# Altium schematic sheet Morpheus_LDO.SchDoc: LDO with Boost Converter
size Letter; CompanyName: Hello Inc.; DrawnBy: Dyke Shaffer; Organization: Hello Inc.; Revision: DVT; SheetNumber: 2; SheetTotal: 4
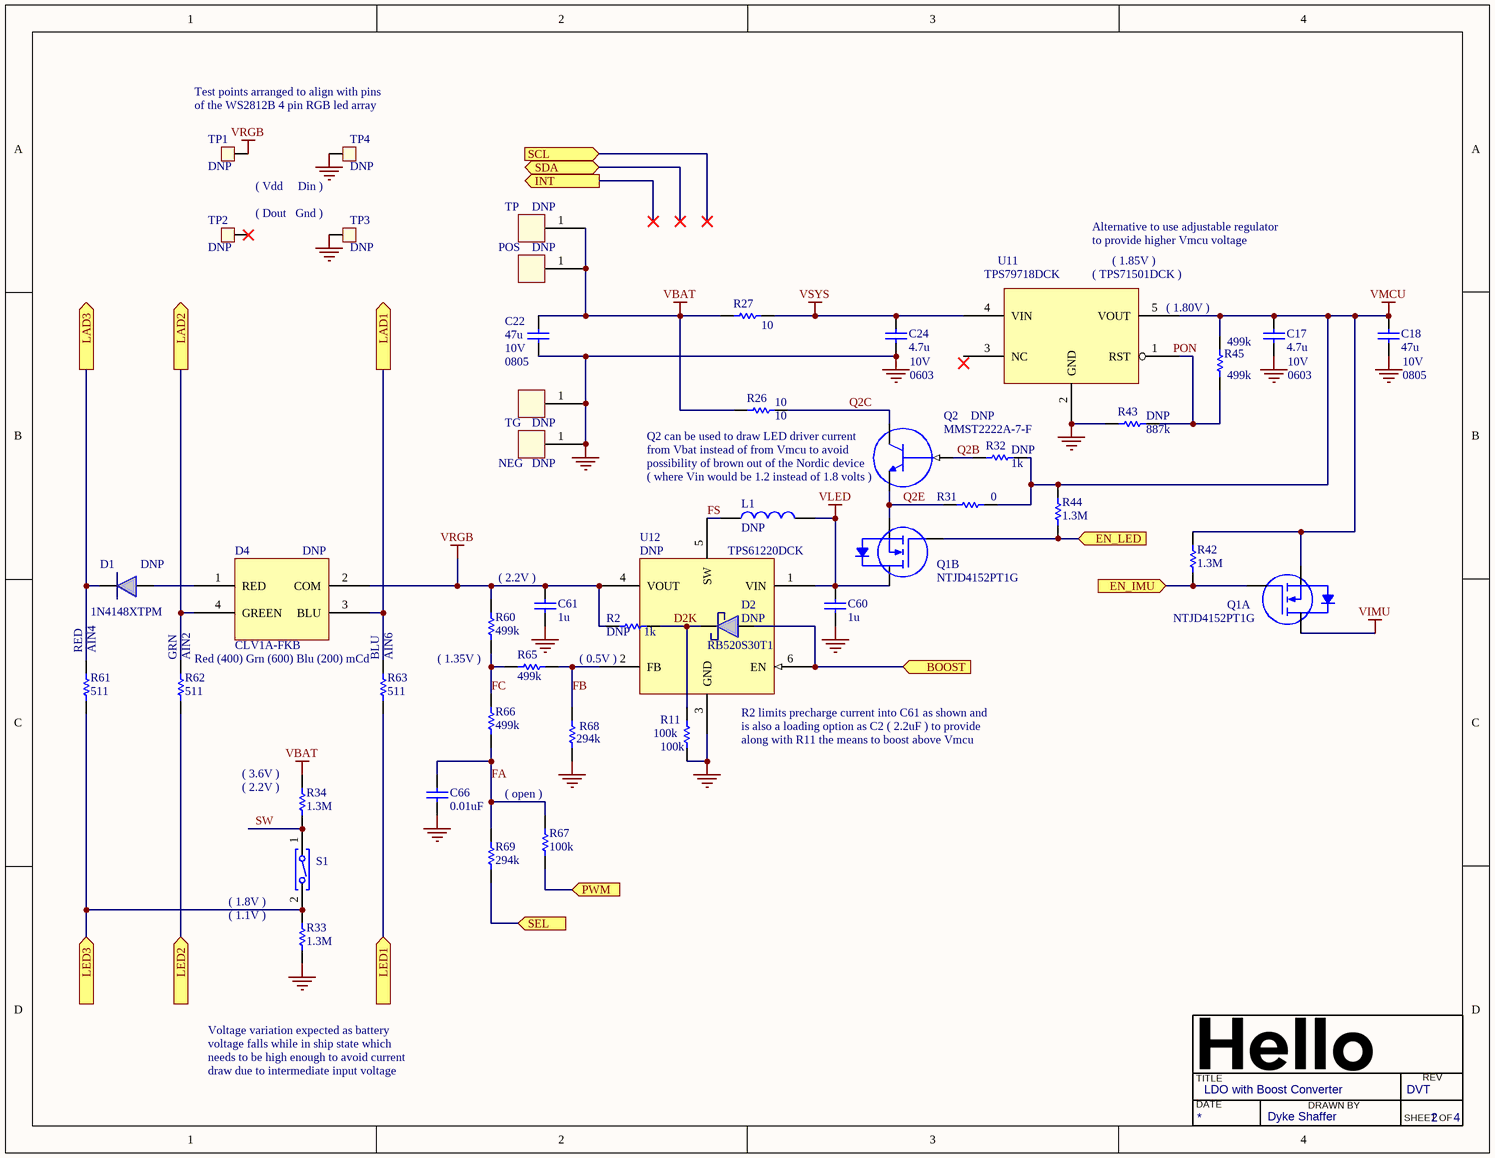
[diagram p0: Morpheus_LDO.SchDoc]

## Parts
C17  4.7u  Size: 0603  Voltage: 10V  [CAP0603_SENSE_DVT]
C18  47u  Size: 0805  Voltage: 10V  [CAP0805_SENSE_DVT]
C22  47u  Size: 0805  Voltage: 10V  [CAP0805_SENSE_DVT]
C24  4.7u  Size: 0603  Voltage: 10V  [CAP0603_SENSE_DVT]
C60  1u  [CAP0402_SENSE_DVT]
C61  1u  [CAP0402_SENSE_DVT]
C66  0.01uF  [CAP0402_SENSE_DVT]
D1  DNP  [SOD523]
D2  DNP  [SOD523]
D4  DNP  value Red (400) Grn (600) Blu (200) mCd  [PLCC150X290P280X320X190-4]
L1  DNP  [IND_1206]
NEG  DNP  [TP0875x050]
POS  DNP  [TP0875x050]
Q1  NTJD4152PT1G  [SOT65P212X110-6N]  (parts A,B of 2)
Q2  DNP  PN: MMST2222A-7-F  [SOT-323]
R2  DNP  value 1k  [RES0402_SENSE_DVT]
R11  100k  [RES0402_SENSE_DVT]
R26  10  [RES0402_SENSE_DVT]
R27  10  [RES0402_SENSE_DVT]
R31  value 0  [RES0402-SENSE-DVT]  (hidden comment: R_0_jumper_0.1_0402)
R32  DNP  value 1k  [RES0402_SENSE_DVT]
R33  1.3M  [RES0402_SENSE_DVT]
R34  1.3M  [RES0402_SENSE_DVT]
R42  1.3M  [RES0402_SENSE_DVT]
R43  DNP  value 887k  [RES0402_SENSE_DVT]
R44  1.3M  [RES0402_SENSE_DVT]
R45  499k  [RES0402_SENSE_DVT]
R60  499k  [RES0402_SENSE_DVT]
R61  511  [RES0402_SENSE_DVT]
R62  511  [RES0402_SENSE_DVT]
R63  511  [RES0402_SENSE_DVT]
R65  499k  [RES0402_SENSE_DVT]
R66  499k  [RES0402_SENSE_DVT]
R67  100k  [RES0402_SENSE_DVT]
R68  294k  [RES0402_SENSE_DVT]
R69  294k  [RES0402_SENSE_DVT]
S1  REED_SPST_NO  [REED-10x1.8]  (value not drawn)
TG  DNP  [TP0875x050]
TP  DNP  [TP0875x050]
TP1  DNP  [TP-0.8]
TP2  DNP  [TP-0.8]
TP3  DNP  [TP-0.8]
TP4  DNP  [TP-0.8]
U11  TPS79718DCK  [SOT65P212X110-5N]
U12  DNP  PN: TPS61220DCK  [SOT65P212X110-6N]

## Ports
BOOST (in), EN_IMU (in), EN_LED (in), INT (out), LAD1 (out), LAD2 (out), LAD3 (out), LED1 (in), LED2 (in), LED3 (in), PWM (in), SCL (in), SDA, SEL (in)

## Nets
GND: C17.1 C18.1 C22.1 C24.1 C60.1 C61.1 C66.1 NEG.1 R11.1 R33.1 R43.1 R68.1 TG.1 TP3.1 TP4.1 U11.2(GND) U12.3(GND)
VBAT: C22.2 POS.1 R26.1 R27.1 R34.2 TP.1
VIMU: Q1.6(D1)
VLED: C60.2 L1.1 Q1.3(D2) U12.1(VIN)
VMCU: C17.2 C18.2 Q1.1(S1) R31.2 R32.2 R42.2 R44.2 R45.2 U11.5(VOUT)
VRGB: C61.2 D4.2(COM) R2.1 R60.2 TP1.1 U12.4(VOUT)
VSYS: C24.2 R27.2 U11.4(VIN)
BOOST: D2.2(Anode) U12.6(EN) ; port BOOST
D2K: D2.1(Cathode) R2.2 R11.2
EN_IMU: Q1.2(G1) R42.1 ; port EN_IMU
EN_LED: Q1.5(G2) R44.1 ; port EN_LED
FA: C66.2 R66.1 R67.2 R69.2
FB: R65.1 R68.2 U12.2(FB)
FC: R60.1 R65.2 R66.2
FS: L1.2 U12.5(SW)
LAD1: D4.3(BLU) R63.2 ; port LAD1
LAD2: D4.4(GREEN) R62.2 ; port LAD2
LAD3: D1.1(Cathode) R61.2 ; port LAD3
LED1: R63.1 ; port LED1
LED2: R62.1 ; port LED2
LED3: R33.2 R61.1 S1.2 ; port LED3
PWM: R67.1 ; port PWM
Q2B: Q2.1(IN) R32.1
Q2C: Q2.3(OUT) R26.2
Q2E: Q1.4(S2) Q2.2(GND) R31.1
SEL: R69.1 ; port SEL
SW: R34.1 S1.1
NetD1_2: D1.2(Anode) D4.1(RED)
NetR43_2: R43.2 R45.1 U11.1(RST)

Not connected (* = marked no-connect by the designer): TP2 1*; U11 3(NC)

## Notes on the sheet
- Test points arranged to align with pins
- of the WS2812B 4 pin RGB led array
- ( Dout   Gnd )
- ( Vdd     Din )
- Alternative to use adjustable regulator
- (near U11) ( TPS71501DCK )
- to provide higher Vmcu voltage
- (near U11) ( 1.85V )
- ( 1.80V )
- (near Q2) Q2 can be used to draw LED driver current
- (near Q2) from Vbat instead of from Vmcu to avoid
- (near Q2) possibility of brown out of the Nordic device
- (near Q2) ( where Vin would be 1.2 instead of 1.8 volts )
- (near C61) ( 2.2V )
- (near R61) RED
- (near R61) AIN4
- (near R62) GRN
- (near R62) AIN2
- (near R63) BLU
- (near R63) AIN6
- (near R60) ( 1.35V )
- (near U12) ( 0.5V )
- (near R34) ( 3.6V )
- (near U12) R2 limits precharge current into C61 as shown and
- (near U12) is also a loading option as C2 ( 2.2uF ) to provide
- along with R11 the means to boost above Vmcu
- (near R34) ( 2.2V )
- ( open )
- ( 1.8V )
- ( 1.1V )
- Voltage variation expected as battery
- voltage falls while in ship state which
- needs to be high enough to avoid current
- draw due to intermediate input voltage
- Labels drawn without touching a wire or pin: PON
- TITLE
- DATE
- DRAWN BY
- REV
- SHEET
- OF

## Library data of the parts
C17 C24 = C_4.7u_20_10_X5R_0603: CAP CER 4.7UF 10V 20% X5R 0603; Vendor: Yageo; PN: CC0603MRX5R6BB475; Hello_PN: 225-00467; item_category: Capacitor; Value: 4.7u; Tolerance: 20%; Temp: X5R
C18 C22 = C_47u_20_10_X5R_0805: CAP CER 47UF 10V 20% X5R 0805; Vendor: Murata; PN: GRM21BR61A476ME15L; Hello_PN: 225-00472; item_category: Capacitor; Value: 47u; Tolerance: 20%; Temp: X5R
C60 C61 = C_1u_10_6.3_X5R_0402: CAP CER 1UF 6.3V 10% X5R 0402; Vendor: Yageo; PN: CC0402KRX5R5BB105; Hello_PN: 225-00470; item_category: Capacitor; Value: 1u; Size: 0402; Tolerance: 10%; Voltage: 6.3V; Temp: X5R
C66 = C_10000p_10_50_X7R_0402: CAP CER 10000PF 50V 10% X7R 0402; Value: 10000p; Vendor: Yageo; PN: CC0402KRX7R9BB103; Voltage: 50; Hello_PN: 225-00469; item_category: Capacitor; Size: 0402; Tolerance: 10%; Temp: X7R
D1 = 1N4148XTPM: Silicon diode, 30V 200mA; Vendor: ON Semi; PN: 1N4148XTPM
D2 = RB520S30T1: Schottky diode, 30V 200mA; Vendor: ON Semi; PN: RB520S30T1
D4 = CLV1A-FKB: RGB LED Array; Vendor: CREE; PN: CLV1A-FKB
L1 = L_2.2u_1206: SMD power inductor, 2.2uH; PN: LQM31PN2R2M00; Vendor: Murata; Value: 2.2u; Tolerance: 20%; RDC: 0.19; I_max: 0.9; I_sat: 1.0; Q: ?
NEG POS TG TP = 5016: Single-pad test point; Value: TP0875x050
Q1 = NTJD4152PT1G: MOSFET 2P-CH 20V 880MA SOT-363; Vendor: ON Semi; Hello_PN: 240-00387; item_category: Transistor; PN: NTJD4152PT1G
Q2 = MMST2222A: NPN Transistor, 20V, 600mA; Vendor: Diodes Inc
R2 R32 = R_1k_1_0.1_0402: Chip Resistor; Vendor: Panasonic; Tolerance: 1 %; Power: 0.1 W; PN: ERJ-2RKF1001X; Model: *; Size: 0402
R11 R67 = R_100k_1_0.1_0402: RES SMD 100K OHM 1% 1/16W 0402; Vendor: Yageo; Power: 0.1 W; PN: RC0402FR-07100KL; Hello_PN: 220-00463; item_category: Resistor; Model: *; Value: 100k; Tolerance: 1 %; Size: 0402
R26 R27 = R_10_1_0.1_0402: RES SMD 10 OHM 1% 1/16W 0402; Vendor: Yageo; Power: 0.1 W; PN: RC0402FR-0710RL; Hello_PN: 220-00464; item_category: Resistor; Model: *; Value: 10; Tolerance: 1 %; Size: 0402
R31 = R_0_jumper_0.1_0402: RES SMD 0.0 OHM JUMPER 1/16W; Vendor: Yageo; Power: 0.1 W; PN: RC0402JR-070RL; Hello_PN: 220-00465; item_category: Resistor; Model: *; Tolerance: Jumper; Size: 0402
R33 R34 R42 R44 = R_1.3M_5_0.1_0402: RES 1.3M OHM 1/10W 5% 0402 SMD; Vendor: Panasonic; Power: 0.1 W; PN: ERJ-2GEJ135X; Hello_PN: 220-00285; item_category: Resistor; Model: *; Value: 1.3M; Tolerance: 5 %; Size: 0402
R43 = R_887k_1_0.1_0402: Chip Resistor; Vendor: Panasonic; Tolerance: 1 %; Power: 0.1 W; PN: ERJ-2RKF8873X; Model: *; Size: 0402
R45 R60 R65 R66 = R_499k_1_0.1_0402: RES 499K OHM 1/10W 1% 0402 SMD; Vendor: Panasonic; Power: 0.1 W; PN: ERJ-2RKF4993X; Hello_PN: 220-00370; item_category: Resistor; Model: *; Value: 499k; Tolerance: 1 %; Size: 0402
R61-R63 = R_511_1_0.1_0402: RES 511 OHM 1/10W 1% 0402 SMD; Vendor: Panasonic; Power: 0.1 W; PN: ERJ-2RKF5110X; Hello_PN: 220-00389; item_category: Resistor; Model: *; Value: 511; Tolerance: 1 %; Size: 0402
R68 R69 = R_294k_1_0.1_0402: RES 294K OHM 1/10W 1% 0402 SMD; Vendor: Panasonic; Power: 0.1 W; PN: ERJ-2RKF2943X; Hello_PN: 220-00390; item_category: Resistor; Model: *; Value: 294k; Tolerance: 1 %; Size: 0402
S1 = SW_REED_SPST_NO: SWITCH REED SPST NO; PN: ORD213-1015; Vendor: ORD; Hello_PN: 216-00399; item_category: Switches
TP1-TP4 = TP-0.8: testpoint; PN: Test Point
U11 = TPS79718DCK: LDO Voltage Regulators EP Ultra Lo-Pwr 10Ma LDO Linear Reg; Vendor: TI; Hello_PN: 260-00193; item_category: IC Analog; PN: TPS79718DCK
U12 = TPS61220: Boost Converter; Vendor: TI